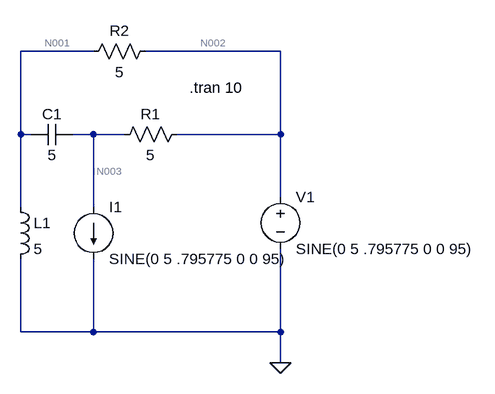
[diagram p0: schematic Challenge 2 - EC2.asc]
Challenge 2 - EC2.asc, the LTspice schematic file:
Version 4
SHEET 1 880 680
WIRE -608 -848 -720 -848
WIRE -320 -848 -528 -848
WIRE -720 -720 -720 -848
WIRE -704 -720 -720 -720
WIRE -608 -720 -640 -720
WIRE -560 -720 -608 -720
WIRE -320 -720 -320 -848
WIRE -320 -720 -480 -720
WIRE -320 -624 -320 -720
WIRE -720 -608 -720 -720
WIRE -608 -608 -608 -720
WIRE -720 -416 -720 -528
WIRE -608 -416 -608 -528
WIRE -608 -416 -720 -416
WIRE -320 -416 -320 -544
WIRE -320 -416 -608 -416
WIRE -320 -368 -320 -416
FLAG -320 -368 0
SYMBOL voltage -320 -640 R0
WINDOW 123 0 0 Left 0
WINDOW 39 0 0 Left 0
SYMATTR InstName V1
SYMATTR Value SINE(0 5 .795775 0 0 95)
SYMBOL cap -640 -736 R90
WINDOW 0 0 32 VBottom 2
WINDOW 3 32 32 VTop 2
SYMATTR InstName C1
SYMATTR Value 5
SYMBOL res -512 -864 R90
WINDOW 0 0 56 VBottom 2
WINDOW 3 32 56 VTop 2
SYMATTR InstName R2
SYMATTR Value 5
SYMBOL res -464 -736 R90
WINDOW 0 0 56 VBottom 2
WINDOW 3 32 56 VTop 2
SYMATTR InstName R1
SYMATTR Value 5
SYMBOL ind -736 -624 R0
SYMATTR InstName L1
SYMATTR Value 5
SYMBOL current -608 -608 R0
WINDOW 123 0 0 Left 0
WINDOW 39 0 0 Left 0
SYMATTR InstName I1
SYMATTR Value SINE(0 5 .795775 0 0 95)
TEXT -460 -792 Left 2 !.tran 10

The netlist it stands for:
* Challenge 2 - EC2.asc
V1 N002 0 SINE(0 5 .795775 0 0 95)
C1 N003 N001 5
R2 N002 N001 5
R1 N002 N003 5
L1 N001 0 5
I1 N003 0 SINE(0 5 .795775 0 0 95)
.tran 10
.backanno
.end

* Results of the author's LTspice run, read from the files saved beside the schematic
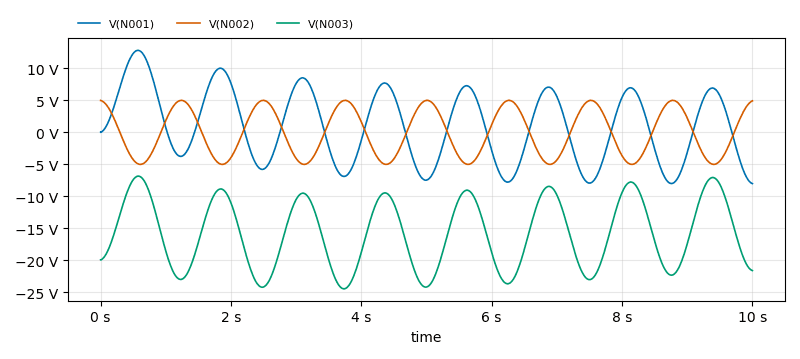
[diagram p1: Transient Analysis of Challenge 2 - EC2.asc, plotted from the saved traces]
* Transient Analysis, 1 run:
*   V(N001): min -7.995 V, max 12.8 V, average 986.4 mV, rms 5.715 V, last -7.995 V
*   V(N002): min -4.997 V, max 4.997 V, average -26.85 mV, rms 3.525 V, last 4.921 V
*   V(N003): min -24.42 V, max -6.832 V, average -15.75 V, rms 16.64 V, last -21.58 V